# EAGLE design Arduino-Pro-Mini_ISP (EAGLE 9.6.0)
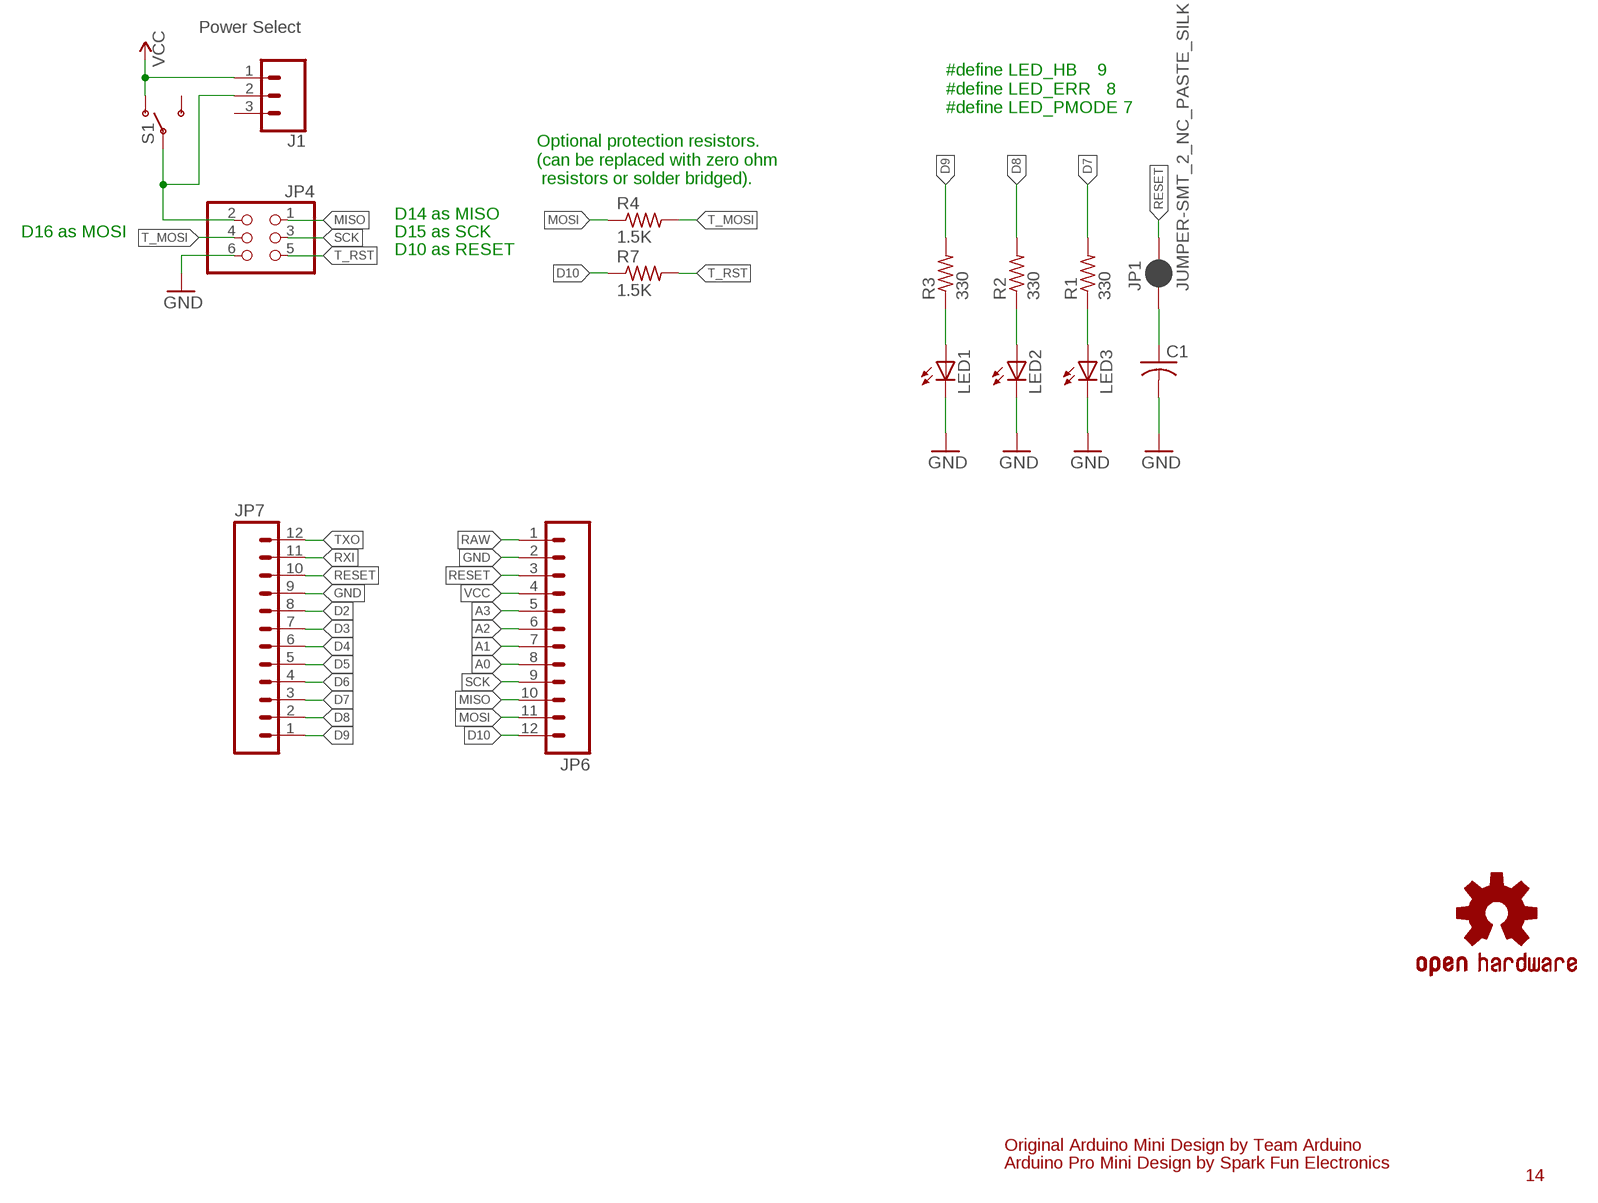
[diagram p0: schematic, sheet 1]

## Parts
C1  C-USC0805  [C0805]
J1  CONN_03  [1X03]
JP1  JUMPER-SMT_2_NC_PASTE_SILK  [SMT-JUMPER_2_NC_PASTE_SILK]
JP4  PINHD-2X3  [2X03]
JP6  M12PTH  [1X12]
JP7  M12PTH  [1X12]
LED1  LEDCHIP-LED0805  [CHIP-LED0805]
LED2  LEDCHIP-LED0805  [CHIP-LED0805]
LED3  LEDCHIP-LED0805  [CHIP-LED0805]
R1  330  R-US_R0805  [R0805]
R2  330  R-US_R0805  [R0805]
R3  330  R-US_R0805  [R0805]
R4  1.5K  R-US_R0805  [R0805]
R7  1.5K  R-US_R0805  [R0805]
S1  Power Select  SWITCH-SPSTSMD  [AYZ0202]
U$3  OSHW-LOGOS  [OSHW-LOGO-S]

## Nets
A0: JP6.8
A1: JP6.7
A2: JP6.6
A3: JP6.5
D2: JP7.8
D3: JP7.7
D4: JP7.6
D5: JP7.5
D6: JP7.4
D7: JP7.3 R1.2
D8: JP7.2 R2.2
D9: JP7.1 R3.2
D10: JP6.12 R7.1
GND [vcc]: C1.2 JP4.6 JP6.2 JP7.9 LED1.C LED2.C LED3.C
MISO: JP4.1 JP6.10
MOSI: JP6.11 R4.1
N$1: LED3.A R1.1
N$2: LED2.A R2.1
N$3: LED1.A R3.1
N$4: C1.1 JP1.1
RAW [vcc]: JP6.1
RESET: JP1.2 JP6.3 JP7.10
RXI: JP7.11
SCK: JP4.3 JP6.9
T_MOSI: JP4.4 R4.2
T_RST: JP4.5 R7.2
TXO: JP7.12
VCC: J1.1 JP6.4 S1.1(O)
VCC2: J1.2 JP4.2 S1.2(P)
Unconnected: J1.3 S1.3(S)

## Notes on the sheet
- #define LED_HB    9
  #define LED_ERR   8
  #define LED_PMODE 7
- Optional protection resistors.
  (can be replaced with zero ohm
   resistors or solder bridged).
- D14 as MISO
- D16 as MOSI | D15 as SCK
- D10 as RESET
- Original Arduino Mini Design by Team Arduino
- Arduino Pro Mini Design by Spark Fun Electronics
- 14

## Library data of the parts
C1 = adafruit:C-US: CAPACITOR, American symbol
J1 = SparkFun-Connectors:CONN_03: Multi connection point. Often used as Generic Header-pin footprint for 0.1 inch spaced/style header connections On any of the 0.1 inch spaced packages, you can populate with these: Break Away Headers - Straight <https://www.sparkfun.com/products/116> (PRT-00116) Break Away Male Headers - Right Angle <https://www.sparkfun.com/products/553> (PRT-00553) Female Headers <https://www.sparkfun.com/products/115> (PRT-00115) Break Away Headers - Machine Pin <https://www.sparkfun.com/products/117> (PRT-00117) Break Away Female Headers - Swiss Machine Pin <https://www.sparkfun.com/products/743> (PRT-00743) Stackable Header - 3 Pin (Female, 0.1") <https://www.sparkfun.com/products/13875> (PRT-13875) For SCREWTERMINALS and SPRING TERMINALS visit here: Screw Terimnals on SparkFun.com <https://www.sparkfun.com/search/results?term=Screw+Terminals> (5mm/3.5mm/2.54mm spacing) This device is also useful as a general connection point to wire up your design to another part of your project. Our various solder wires solder well into these plated through hole pads. Hook-Up Wire - Assortment (Stranded, 22 AWG) <https://www.sparkfun.com/products/11375> (PRT-11375) Hook-Up Wire - Assortment (Solid Core, 22 AWG) <https://www.sparkfun.com/products/11367> (PRT-11367) View the entire wire category on our website here <https://www.sparkfun.com/categories/141> Special notes: Molex polarized connector foot print use with SKU : PRT-08232 with associated crimp pins and housings.
JP1 = SparkFun-Jumpers:JUMPER-SMT_2_NC_PASTE: Normally closed solder jumper This jumper has an aperture in the stencil to allow solder paste to bridge the split in the wire so it's normally closed (NC). Wick off the solder to open the connection. Reapply solder to reclose the connection.
JP4 = pinhead-ez:PINHD-2X3: PIN HEADER
JP6 JP7 = SparkFun:M12: Header 12 Standard 12-pin 0.1" header. Use with straight break away headers (SKU : PRT-00116), right angle break away headers (PRT-00553), swiss pins (PRT-00743), machine pins (PRT-00117), and female headers (PRT-00115).
LED1-LED3 = adafruit:LED: LED OSRAM: - CHIPLED LG R971, LG N971, LY N971, LG Q971, LY Q971, LO R971, LY R971 LH N974, LH R974 LS Q976, LO Q976, LY Q976 LO Q996 - Hyper CHIPLED LW Q18S LB Q993, LB Q99A, LB R99A - SideLED LS A670, LO A670, LY A670, LG A670, LP A670 LB A673, LV A673, LT A673, LW A673 LH A674 LY A675 LS A676, LA A676, LO A676, LY A676, LW A676 LS A679, LY A679, LG A679 - Hyper Micro SIDELED® LS Y876, LA Y876, LO Y876, LY Y876 LT Y87S - SmartLED LW L88C, LW L88S LB L89C, LB L89S, LG L890 LS L89K, LO L89K, LY L89K LS L896, LA L896, LO L896, LY L896 - TOPLED LS T670, LO T670, LY T670, LG T670, LP T670 LSG T670, LSP T670, LSY T670, LOP T670, LYG T670 LG T671, LOG T671, LSG T671 LB T673, LV T673, LT T673, LW T673 LH T674 LS T676, LA T676, LO T676, LY T676, LB T676, LH T676, LSB T676, LW T676 LB T67C, LV T67C, LT T67C, LS T67K, LO T67K, LY T67K, LW E67C LS E67B, LA E67B, LO E67B, LY E67B, LB E67C, LV E67C, LT E67C LW T67C LS T679, LY T679, LG T679 LS T770, LO T770, LY T770, LG T770, LP T770 LB T773, LV T773, LT T773, LW T773 LH T774 LS E675, LA E675, LY E675, LS T675 LS T776, LA T776, LO T776, LY T776, LB T776 LHGB T686 LT T68C, LB T68C - Hyper Mini TOPLED® LB M676 - Mini TOPLED Santana® LG M470 LS M47K, LO M47K, LY M47K Source: http://www.osram.convergy.de/
R1-R4 R7 = rcl-ez:R-US_: RESISTOR, American symbol
S1 = SparkFun:SWITCH-SPST: SPST Switch Simple slide switch. Spark Fun Electronics SKU : COM-00102
U$3 = SparkFun:OSHW-LOGO: Open Source Hardware Logo This logo indicates the piece of hardware it is found on incorporates a OSHW license and/or adheres to the definition of open source hardware found here: http://freedomdefined.org/OSHW

## Net classes
0 default: width 0.203 mm
1 vcc: width 0.254 mm

## Board
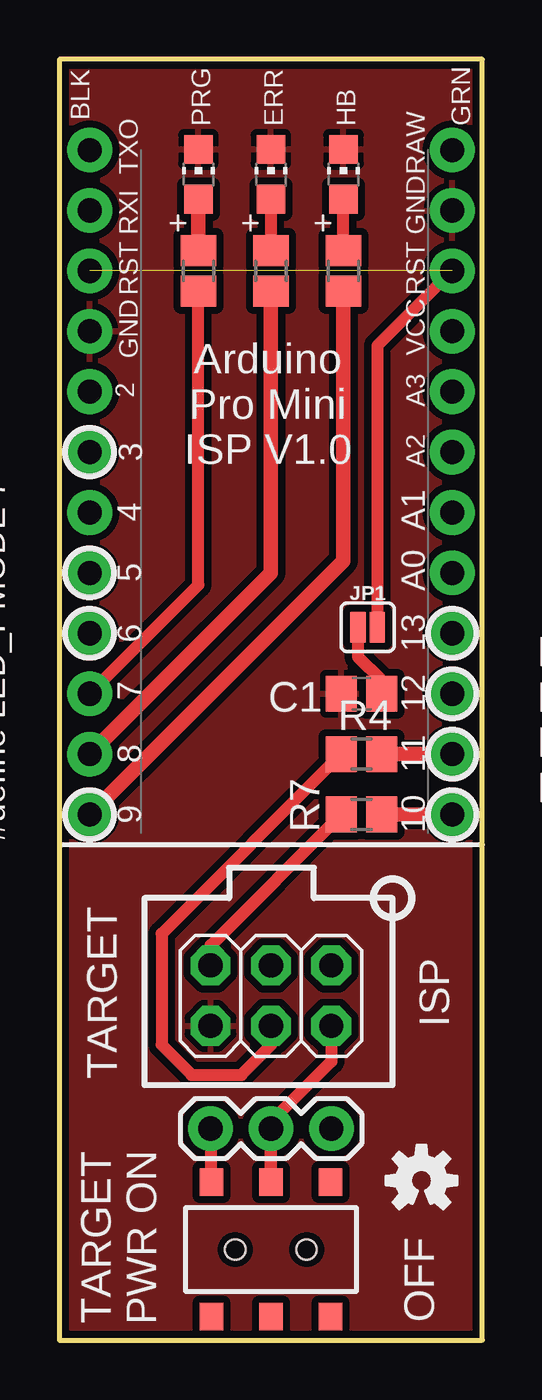
[diagram p1: board, top side]
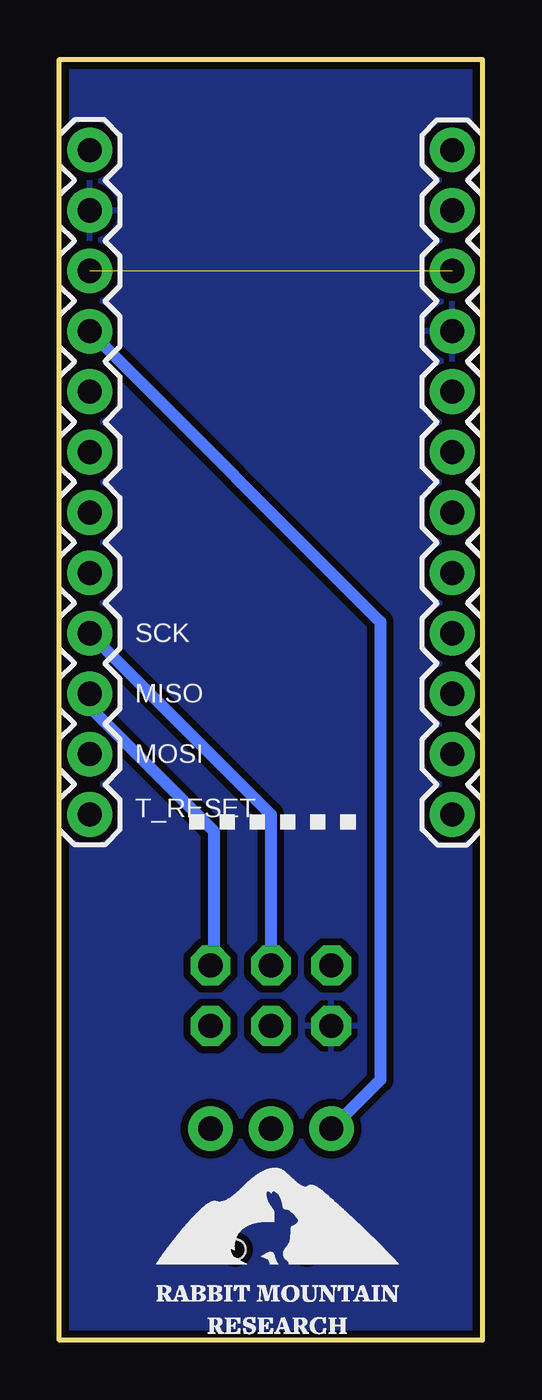
[diagram p2: board, bottom side, seen from below]

Size 17.78 x 53.85 mm. Coordinates in mm from the lower left corner, seen from the top.
Outline: 0,53.85 0,0 17.78,0 17.78,53.85 0,53.85
Copper layers (1*16): Top 0.035mm / dielectric 1.5mm / Bottom 0.035mm
Design rules "SparkFun-2-layer *": minimum track width 7mil, minimum drill 15mil, track to track 8mil, track to pad 8mil, pad to pad 8mil, via to via 8mil, smd to smd 8mil, copper to edge 8mil, drill to drill 8mil, minimum pad ring 12mil, minimum via ring 10mil, stop-mask expansion 4mil, vias tented up to drill 20mil, thermal gap 10mil

### Footprints (pad centres in the part's own frame; a part is rotated, then mirrored left to right if it is on the bottom)
C0805 = smd 1.3 x 1.5: 1 -0.85,0; 2 0.85,0
1X03 = drill 1.016 pad 1.88: 1 0,0; 2 2.54,0; 3 5.08,0
SMT-JUMPER_2_NC_PASTE_SILK = smd 0.635 x 1.27: 1 -0.406,0; 2 0.406,0
2X03 = drill 1.016 pad 1.676 octagon: 1 -2.54,-1.27; 2 -2.54,1.27; 3 0,-1.27; 4 0,1.27; 5 2.54,-1.27; 6 2.54,1.27
1X12 = drill 1.016 pad 1.88: 1 0,0; 2 2.54,0; 3 5.08,0; 4 7.62,0; 5 10.16,0; 6 12.7,0; 7 15.24,0; 8 17.78,0; 9 20.32,0; 10 22.86,0; 11 25.4,0; 12 27.94,0
CHIP-LED0805 = smd 1.2 x 1.2: A 0,-1.05; C 0,1.05
R0805 = smd 1.3 x 1.5: 1 -0.85,0; 2 0.85,0
AYZ0202 = smd 1 x 1.15: 1 -2.5,2.825; 2 0,2.825; 3 2.5,2.825; 4 -2.5,-2.825; 5 0,-2.825; 6 2.5,-2.825 | hole 0.85: 1.5,0; -1.5,0

### Placement (x,y rotation side)
C1  12.7,27.18 180 top
J1  6.35,8.89 0 top
JP1  12.95,29.97 0 top
JP4  8.89,14.48 180 top
JP6  16.51,50.04 270 bottom
JP7  1.27,22.1 90 bottom
LED1  11.94,49.02 0 top
LED2  8.89,49.02 0 top
LED3  5.84,49.02 0 top
R1  5.84,44.96 270 top
R2  8.89,44.96 270 top
R3  11.94,44.96 270 top
R4  12.7,24.64 180 top
R7  12.7,22.1 180 top
S1  8.89,3.81 0 top
U$1  [RMR-SIT-7MM]  13.72,0.25 0 bottom
U$3  15.21,6.71 0 top

### Tracks (layer width: path | path; a pad name or v marks a point on that pad's centre or on a via)
D7
  Top 0.508: JP7.3 5.84,31.75 R1.2
D8
  Top 0.61: R2.2 8.89,32.26 JP7.2
D9
  Top 0.61: R3.2 11.94,32.77 JP7.1
D10
  Top 0.61: R7.1 JP6.12
GND
  pour Top (isolate 0.305): -0.51,54.36 18.29,54.36 18.29,-0.51 -0.51,-0.51
  pour Bottom (isolate 0.305): -0.25,54.1 18.03,54.1 18.03,-0.25 -0.25,-0.25
MISO
  Bottom 0.508: JP6.10 16.51,26.61 11.3,21.41 11.3,15.88 JP4.1
MOSI
  Top 0.61: R4.1 JP6.11
N$1
  Top 0.61: LED3.A R1.1
N$2
  Top 0.508: LED2.A R2.1
N$3
  Top 0.508: R3.1 LED1.A
N$4
  Top 0.508: JP1.1 12.55,28.73 13.55,27.72 C1.1
RESET  (1 unrouted)
  Top 0.508: JP6.3 13.36,41.81 JP1.2
SCK
  Bottom 0.508: JP6.9 8.89,22.1 JP4.3
T_MOSI
  Top 0.508: R4.2 4.29,17.08 4.29,12.42 5.56,11.15 7.65,11.15 8.89,12.39 JP4.4
T_RST
  Top 0.508: R7.2 6.35,16.6 JP4.5
VCC
  Top 0.508: J1.1 6.35,6.67 S1.1
  Bottom 0.508: J1.1 4.29,10.95 4.29,30.2 JP6.4
VCC2
  Top 0.508: JP4.2 11.43,11.71 8.89,9.17 S1.2 J1.2

### Text on the board
tPlace: BLK | PRG | ERR | HB | GRN | TXO | RAW | RXI | GND | RST | RST | VCC | GND | 2 | A3 | 3 | Arduino / Pro Mini / ISP V1.0 | A2 | 4 | A1 | 5 | A0 | 6 | 13 | 7 | 12 | 8 | 11 | D13 as SCK / D12 as MISO / D11 as MOSI / D10 as RESET | 9 | 10 | #define LED_HB 9 / #define LED_ERR 8 / #define LED_PMODE 7 | TARGET | ISP | TARGET / PWR ON | OFF
bPlace: SCK | MISO | MOSI | T_RESET